# Altium schematic sheet VCU.SchDoc
size A3; SheetNumber: 1; SheetTotal: 1
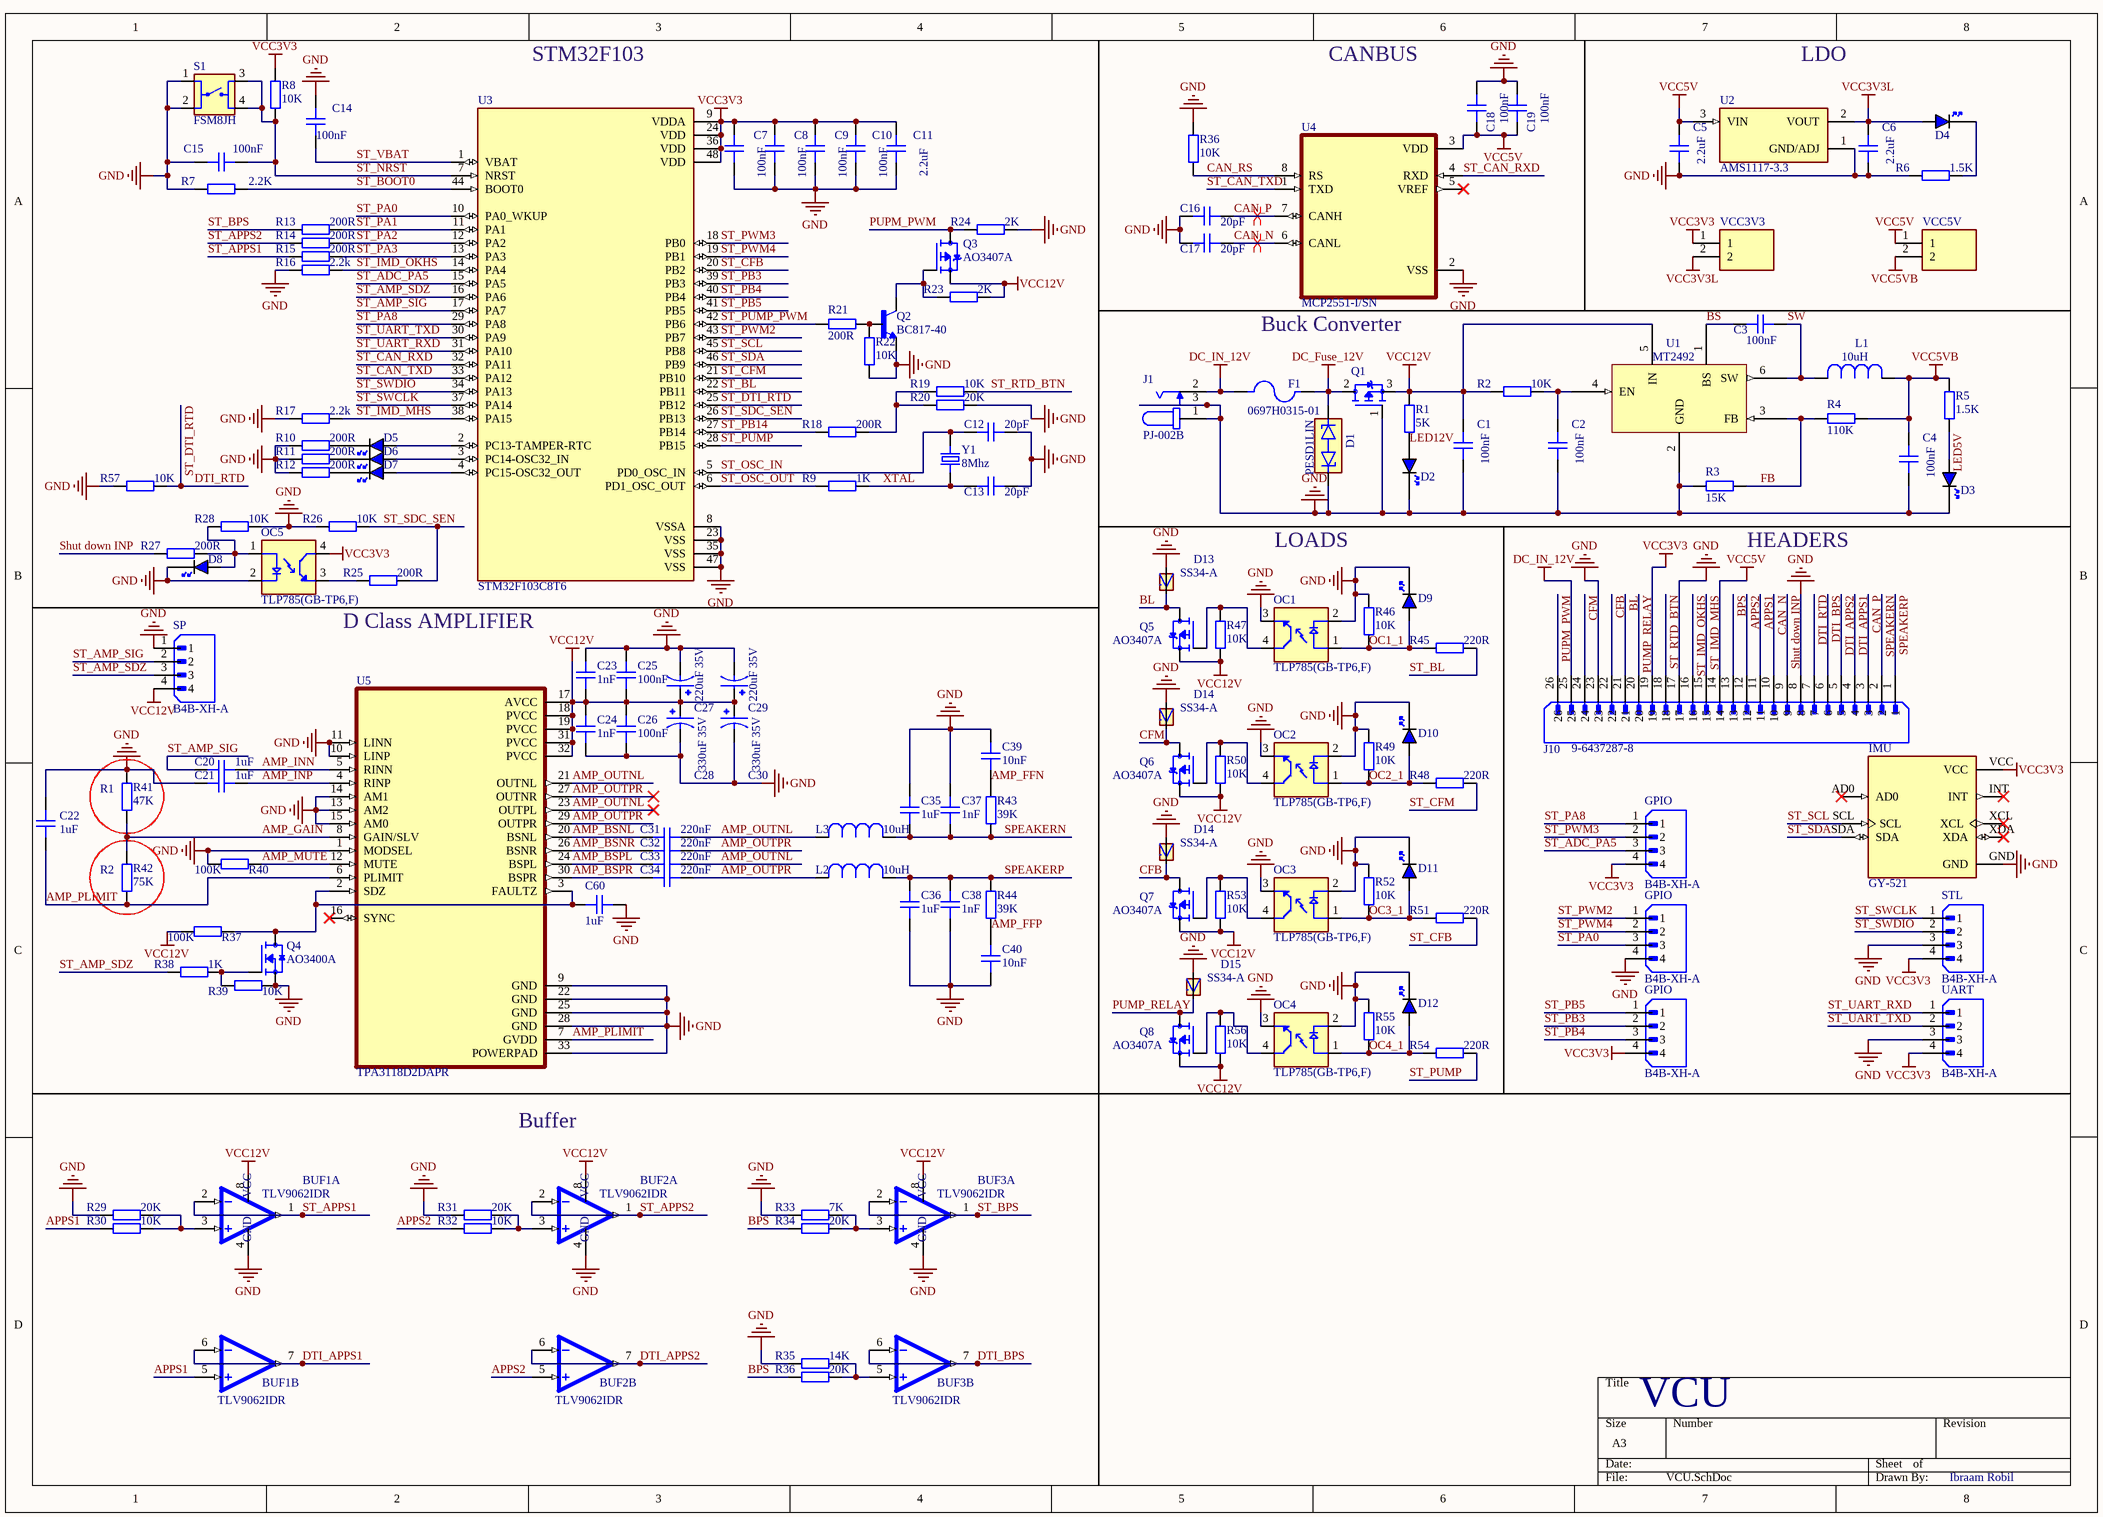
[diagram p0: VCU.SchDoc]

## Parts
(Parts that share a designator on the sheet are numbered #1, #2 ... from top to bottom, then left to right.)
BUF1  TLV9062IDR  [SOIC127P599X175-8N]  (parts A,B of 2)
BUF2  TLV9062IDR  [SOIC127P599X175-8N]  (parts A,B of 2)
BUF3  TLV9062IDR  [SOIC127P599X175-8N]  (parts A,B of 2)
C1  100nF  [CAP_0805]
C2  100nF  [CAP_0805]
C3  100nF  [CAP_0805]
C4  100nF  [CAP_0805]
C5  2.2uF  [CAP_0805]
C6  2.2uF  [CAP_0805]
C7  100nF  [CAP_0805]
C8  100nF  [CAP_0805]
C9  100nF  [CAP_0805]
C10  100nF  [CAP_0805]
C11  2.2uF  [CAP_0805]
C12  20pF  [CAP_0805]
C13  20pF  [CAP_0805]
C14  100nF  [CAP_0805]
C15  100nF  [CAP_0805]
C16  20pF  [CAP_0805]
C17  20pF  [CAP_0805]
C18  100nF  [CAP_0805]
C19  100nF  [CAP_0805]
C20  1uF  [CAP_0805]
C21  1uF  [CAP_0805]
C22  1uF  [CAP_0805]
C23  1nF  [CAP_0805]
C24  1nF  [CAP_0805]
C25  100nF  [CAP_0805]
C26  100nF  [CAP_0805]
C27  220uF 35V  [CAP_EEEFT1E471AP]
C28  330uF 35V  [CAP_EEEFT1E471AP]
C29  220uF 35V  [CAP_EEEFT1E471AP]
C30  330uF 35V  [CAP_EEEFT1E471AP]
C31  220nF  [CAP_0805]
C32  220nF  [CAP_0805]
C33  220nF  [CAP_0805]
C34  220nF  [CAP_0805]
C35  1uF  [CAP_0805]
C36  1uF  [CAP_0805]
C37  1nF  [CAP_0805]
C38  1nF  [CAP_0805]
C39  10nF  [CAP_0805]
C40  10nF  [CAP_0805]
C60  1uF  [CAP_0805]
D1  PESD1LIN  [DIO_PESD1LIN]
D2  BLUE  [LED_0805_BLUE]  (value not drawn)
D3  BLUE  [LED_0805_BLUE]  (value not drawn)
D4  BLUE  [LED_0805_BLUE]  (value not drawn)
D5  BLUE  [LED_0805_BLUE]  (value not drawn)
D6  BLUE  [LED_0805_BLUE]  (value not drawn)
D7  BLUE  [LED_0805_BLUE]  (value not drawn)
D8  BLUE  [LED_0805_BLUE]  (value not drawn)
D9  BLUE  [LED_0805_BLUE]  (value not drawn)
D10  BLUE  [LED_0805_BLUE]  (value not drawn)
D11  BLUE  [LED_0805_BLUE]  (value not drawn)
D12  BLUE  [LED_0805_BLUE]  (value not drawn)
D13  SS34-A  [DO-214AC]
D14#1  SS34-A  [DO-214AC]
D14#2  SS34-A  [DO-214AC]
D15  SS34-A  [DO-214AC]
F1  0697H0315-01  [FUSRR508W60L835T400H810]
GPIO#1  B4B-XH-A  [JST_B4B-XH-A]
GPIO#2  B4B-XH-A  [JST_B4B-XH-A]
GPIO#3  B4B-XH-A  [JST_B4B-XH-A]
IMU  GY-521  [MODULE_GY-521]
J1  PJ-002B  [CUI_PJ-002B]
J10  9-6437287-8  [TE_9-6437287-8]
L1  10uH  [IND_CDRH127/LDNP-470MC_SUM]
L2  10uH  [IND_CDRH127/LDNP-470MC_SUM]
L3  10uH  [IND_CDRH127/LDNP-470MC_SUM]
OC1  TLP785(GB-TP6,F)  [SOIC254P960X420-4N]
OC2  TLP785(GB-TP6,F)  [SOIC254P960X420-4N]
OC3  TLP785(GB-TP6,F)  [SOIC254P960X420-4N]
OC4  TLP785(GB-TP6,F)  [SOIC254P960X420-4N]
OC5  TLP785(GB-TP6,F)  [SOIC254P960X420-4N]
Q1  IRF4905STRRPBF  [TRANS_IRF4905STRRPBF]  (value not drawn)
Q2  BC817-40  [SOT95P240X120-3N]
Q3  AO3407A  [SOT95P280X125-3N]
Q4  AO3400A  [SOT95P280X125-3N]
Q5  AO3407A  [SOT95P280X125-3N]
Q6  AO3407A  [SOT95P280X125-3N]
Q7  AO3407A  [SOT95P280X125-3N]
Q8  AO3407A  [SOT95P280X125-3N]
R1  5K  [RES_0805]
R2  10K  [RES_0805]
R3  15K  [RES_0805]
R4  110K  [RES_0805]
R5  1.5K  [RES_0805]
R6  1.5K  [RES_0805]
R7  2.2K  [RES_0805]
R8  10K  [RES_0805]
R9  1K  [RES_0805]
R10  200R  [RES_0805]
R11  200R  [RES_0805]
R12  200R  [RES_0805]
R13  200R  [RES_0805]
R14  200R  [RES_0805]
R15  200R  [RES_0805]
R16  2.2k  [RES_0805]
R17  2.2k  [RES_0805]
R18  200R  [RES_0805]
R19  10K  [RES_0805]
R20  20K  [RES_0805]
R21  200R  [RES_0805]
R22  10K  [RES_0805]
R23  2K  [RES_0805]
R24  2K  [RES_0805]
R25  200R  [RES_0805]
R26  10K  [RES_0805]
R27  200R  [RES_0805]
R28  10K  [RES_0805]
R29  20K  [RES_0805]
R30  10K  [RES_0805]
R31  20K  [RES_0805]
R32  10K  [RES_0805]
R33  7K  [RES_0805]
R34  20K  [RES_0805]
R35  14K  [RES_0805]
R36#1  10K  [RES_0805]
R36#2  20K  [RES_0805]
R37  100K  [RES_0805]
R38  1K  [RES_0805]
R39  10K  [RES_0805]
R40  100K  [RES_0805]
R41  47K  [RES_0805]
R42  75K  [RES_0805]
R43  39K  [RES_0805]
R44  39K  [RES_0805]
R45  220R  [RES_0805]
R46  10K  [RES_0805]
R47  10K  [RES_0805]
R48  220R  [RES_0805]
R49  10K  [RES_0805]
R50  10K  [RES_0805]
R51  220R  [RES_0805]
R52  10K  [RES_0805]
R53  10K  [RES_0805]
R54  220R  [RES_0805]
R55  10K  [RES_0805]
R56  10K  [RES_0805]
R57  10K  [RES_0805]
S1  FSM8JH  [SW_FSM8JH]
SP  B4B-XH-A  [JST_B4B-XH-A]
STL  B4B-XH-A  [JST_B4B-XH-A]
U1  MT2492  [PCBComponent_1 - duplicate]
U2  AMS1117-3.3  [SOT229P700X180-4N]
U3  STM32F103C8T6  [QFP50P900X900X160-48N]
U4  MCP2551-I/SN  [SOIC127P599X175-8N]
U5  TPA3118D2DAPR  [SOP65P810X120-33N]
UART  B4B-XH-A  [JST_B4B-XH-A]
VCC3V3  3-644456-2  [TE_3-644456-2]  (value not drawn)
VCC5V  3-644456-2  [TE_3-644456-2]  (value not drawn)
Y1  8Mhz  [XTAL_ECS-80-20-5PVX]

## Nets
DC_Fuse_12V: D1.2 F1.2 Q1.2(D)
DC_IN_12V: F1.1 J1.2 J10.25
GND: BUF1.4(V-) BUF2.4(V-) BUF3.4(V-) C1.2 C2.2 C4.2 C5.2 C6.2 C7.1 C8.1 C9.1 C10.1 C11.2 C12.1 C13.1 C14.1 C15.2 C16.2 C17.2 C18.2 C19.2 C21.1 C22.2 C23.2 C24.1 C25.2 C26.1 C27.2 C28.2 C29.2 C30.2 C35.2 C36.2 C37.2 C38.2 C39.2 C40.2 C60.1 D1.1 D2.K D3.K D8.K D9.K D10.K D11.K D12.K D13.A D14#1.A D14#2.A D15.A GPIO#2.4 IMU.GND J1.1 J1.3 J10.8 J10.17 J10.23 OC1.2(C) OC1.3(ET) OC2.2(C) OC2.3(ET) OC3.2(C) OC3.3(ET) OC4.2(C) OC4.3(ET) OC5.2(C) Q1.1(G) Q2.2(E) Q4.2(S) R3.1 R6.2 R7.1 R10.2 R11.2 R12.2 R16.2 R17.2 R20.2 R22.2 R24.1 R26.2 R28.1 R29.2 R31.2 R33.2 R35.2 R36#1.2 R39.1 R40.1 R41.2 R46.2 R49.2 R52.2 R55.2 R57.2 S1.1 S1.2 SP.1 STL.3 U1.2(GND) U2.1(GND/ADJ) U3.8(VSSA) U3.23(VSS) U3.35(VSS) U3.47(VSS) U4.2(VSS) U5.1(MODSEL) U5.9(GND) U5.10(LINP) U5.11(LINN) U5.13(AM2) U5.14(AM1) U5.15(AM0) U5.22(GND) U5.25(GND) U5.28(GND) U5.33(POWERPAD) UART.3
VCC3V3: C7.2 C8.2 C9.2 C10.2 C11.1 GPIO#1.4 GPIO#3.4 IMU.VCC J10.19 OC5.4(CT) R8.2 STL.4 U3.9(VDDA) U3.24(VDD) U3.36(VDD) U3.48(VDD) UART.4 VCC3V3.1
VCC3V3L: C6.1 D4.A U2.2(VOUT) VCC3V3.2
VCC5V: C5.1 C18.1 C19.1 J10.14 U2.3(VIN) U4.3(VDD) VCC5V.1
VCC5VB: C4.1 L1.1 R4.2 R5.2 VCC5V.2
VCC12V: BUF1.8(V+) BUF2.8(V+) BUF3.8(V+) C1.1 C23.1 C24.2 C25.1 C26.2 C27.1 C28.1 C29.1 C30.1 Q1.3(S) Q3.2(S) Q5.2(S) Q6.2(S) Q7.2(S) Q8.2(S) R1.2 R2.2 R23.2 R37.1 R47.1 R50.1 R53.1 R56.1 SP.4 U1.5(IN) U5.17(AVCC) U5.18(PVCC) U5.19(PVCC) U5.31(PVCC) U5.32(PVCC)
AMP_BSNL: C31.2 U5.20(BSNL)
AMP_BSNR: C32.2 U5.26(BSNR)
AMP_BSPL: C33.2 U5.24(BSPL)
AMP_BSPR: C34.2 U5.30(BSPR)
AMP_FFN: C39.1 R43.2
AMP_FFP: C40.1 R44.2
AMP_GAIN: R41.1 R42.2 U5.8(GAIN/SLV)
AMP_INN: C20.2 U5.5(RINN)
AMP_INP: C21.2 U5.4(RINP)
AMP_MUTE: R40.2 U5.12(MUTE)
AMP_OUTNL: C31.1 C33.1 L3.2 U5.21(OUTNL) U5.23(OUTPL)
AMP_OUTPR: C32.1 C34.1 L2.2 U5.27(OUTNR) U5.29(OUTPR)
AMP_PLIMIT: C22.1 R42.1 U5.6(PLIMIT) U5.7(GVDD)
APPS1: BUF1.5(2IN+) J10.11 R30.2
APPS2: BUF2.5(2IN+) J10.12 R32.2
BL: D13.C J10.21 Q5.3(D)
BPS: J10.13 R34.2 R36#2.2
BS: C3.1 U1.1(BS)
CAN_N: C17.1 J10.10 U4.6(CANL)
CAN_P: C16.1 J10.3 U4.7(CANH)
CAN_RS: R36#1.1 U4.8(RS)
CFB: D14#2.C J10.22 Q7.3(D)
CFM: D14#1.C J10.24 Q6.3(D)
DTI_APPS1: BUF1.6(2IN-) BUF1.7(2OUT) J10.4
DTI_APPS2: BUF2.6(2IN-) BUF2.7(2OUT) J10.5
DTI_BPS: BUF3.6(2IN-) BUF3.7(2OUT) J10.6
DTI_RTD: J10.7 R57.1 U3.25(PB12)  [also labelled ST_DTI_RTD]
FB: R3.2 R4.1 U1.3(FB)
LED5V: D3.A R5.1
LED12V: D2.A R1.1
OC1_1: D9.A OC1.1(A) R45.2 R46.1
OC2_1: D10.A OC2.1(A) R48.2 R49.1
OC3_1: D11.A OC3.1(A) R51.2 R52.1
OC4_1: D12.A OC4.1(A) R54.2 R55.1
PUMP_RELAY: D15.C J10.20 Q8.3(D)
PUPM_PWM: J10.26 Q3.3(D) R24.2
Shut down INP: J10.9 R27.2
SPEAKERN: C35.1 C37.1 J10.2 L3.1 R43.1
SPEAKERP: C36.1 C38.1 J10.1 L2.1 R44.1
ST_ADC_PA5: GPIO#1.3 U3.15(PA5)
ST_AMP_SDZ: R38.1 SP.3 U3.16(PA6)
ST_AMP_SIG: C20.1 SP.2 U3.17(PA7)
ST_APPS1: BUF1.1(1OUT) BUF1.2(1IN-) R15.2
ST_APPS2: BUF2.1(1OUT) BUF2.2(1IN-) R14.2
ST_BL: R45.1 U3.22(PB11)
ST_BOOT0: R7.2 U3.44(BOOT0)
ST_BPS: BUF3.1(1OUT) BUF3.2(1IN-) R13.2
ST_CAN_RXD: U3.32(PA11) U4.4(RXD)
ST_CAN_TXD: U3.33(PA12) U4.1(TXD)
ST_CFB: R51.1 U3.20(PB2)
ST_CFM: R48.1 U3.21(PB10)
ST_IMD_MHS: J10.15 R17.1 U3.38(PA15)
ST_IMD_OKHS: J10.16 R16.1 U3.14(PA4)
ST_NRST: C15.1 R8.1 S1.3 S1.4 U3.7(NRST)
ST_OSC_IN: C12.2 U3.5(PD0_OSC_IN) Y1.1
ST_OSC_OUT: R9.1 U3.6(PD1_OSC_OUT)
ST_PA0: GPIO#2.3 U3.10(PA0_WKUP)
ST_PA1: R13.1 U3.11(PA1)
ST_PA2: R14.1 U3.12(PA2)
ST_PA3: R15.1 U3.13(PA3)
ST_PA8: GPIO#1.1 U3.29(PA8)
ST_PB3: GPIO#3.2 U3.39(PB3)
ST_PB4: GPIO#3.3 U3.40(PB4)
ST_PB5: GPIO#3.1 U3.41(PB5)
ST_PB14: R18.1 U3.27(PB14)
ST_PUMP: R54.1 U3.28(PB15)
ST_PUMP_PWM: R21.2 U3.42(PB6)
ST_PWM2: GPIO#2.1 U3.43(PB7)
ST_PWM3: GPIO#1.2 U3.18(PB0)
ST_PWM4: GPIO#2.2 U3.19(PB1)
ST_RTD_BTN: J10.18 R19.2
ST_SCL: IMU.SCL U3.45(PB8)
ST_SDA: IMU.SDA U3.46(PB9)
ST_SDC_SEN: R25.2 R26.1 U3.26(PB13)
ST_SWCLK: STL.1 U3.37(PA14)
ST_SWDIO: STL.2 U3.34(PA13)
ST_UART_RXD: U3.31(PA10) UART.1
ST_UART_TXD: U3.30(PA9) UART.2
ST_VBAT: C14.2 U3.1(VBAT)
SW: C3.2 L1.2 U1.6(SW)
XTAL: C13.2 R9.2 Y1.2
NetBUF1_3: BUF1.3(1IN+) R29.1 R30.1
NetBUF2_3: BUF2.3(1IN+) R31.1 R32.1
NetBUF3_3: BUF3.3(1IN+) R33.1 R34.1
NetBUF3_5: BUF3.5(2IN+) R35.1 R36#2.1
NetC2_1: C2.1 R2.1 U1.4(EN)
NetC60_2: C60.2 Q4.3(D) R37.2 U5.2(SDZ) U5.3(FAULTZ)
NetD4_K: D4.K R6.1
NetD5_A: D5.A U3.2(PC13-TAMPER-RTC)
NetD5_K: D5.K R10.1
NetD6_A: D6.A U3.3(PC14-OSC32_IN)
NetD6_K: D6.K R11.1
NetD7_A: D7.A U3.4(PC15-OSC32_OUT)
NetD7_K: D7.K R12.1
NetD8_A: D8.A OC5.1(A) R27.1 R28.2
NetOC1_4: OC1.4(CT) Q5.1(G) R47.2
NetOC2_4: OC2.4(CT) Q6.1(G) R50.2
NetOC3_4: OC3.4(CT) Q7.1(G) R53.2
NetOC4_4: OC4.4(CT) Q8.1(G) R56.2
NetOC5_3: OC5.3(ET) R25.1
NetQ2_1: Q2.1(B) R21.1 R22.1
NetQ2_3: Q2.3(C) Q3.1(G) R23.1
NetQ4_1: Q4.1(G) R38.2 R39.2
NetR18_2: R18.2 R19.1 R20.1

Not connected (* = marked no-connect by the designer): IMU AD0* INT* XCL* XDA*; U4 5(VREF)*; U5 16(SYNC)*

## Layout directives
differential pair: CAN_N, CAN_P

## Notes on the sheet
- STM32F103
- CANBUS
- LDO
- Buck Converter
- LOADS
- (near R3) HEADERS
- D Class AMPLIFIER
- (near R41) R1
- (near R42) R2
- Buffer
- VCU
- Ibraam Robil
- (in symbol TLV9062IDR, part A) VCC; GND

## Library data of the parts
BUF1-BUF3 = TLV9062IDR: Dual, 5.5-V, 10-MHz operational amplifier; MF: Texas Instruments; SnapEDA_Link: https://www.snapeda.com/parts/TLV9062IDR/Texas+Instruments/view-part/?ref=snap; Package: SOIC-8 Texas Instruments; Value: *; MP: TLV9062IDR; Check_prices: https://www.snapeda.com/parts/TLV9062IDR/Texas+Instruments/view-part/?ref=eda
C1-C26 C31-C40 C60 = CAP_0805: Capacitor SMD 0805; Manufacturer: *; Manufacturer Part Number: *; Distributor Link: *; LCSC: *; Rating: *; Dielectric: *
C27-C30 = EEEFT1E471AP: Cap Aluminum Lytic 470uF 25V 20% (8 X 10.2mm) SMD 0.08 Ohm 850mA 2000h 105C Automotive T/R; MF: Panasonic; SnapEDA_Link: https://www.snapeda.com/parts/EEEFT1E471AP/Panasonic/view-part/?ref=snap; Package: RADIAL-2 Panasonic; Value: *; MP: EEEFT1E471AP; Check_prices: https://www.snapeda.com/parts/EEEFT1E471AP/Panasonic/view-part/?ref=eda
D1 = PESD1LIN: 44V, 70V Clamp 3A (8/20Âµs) Ipp Tvs Diode Surface Mount SOD-323; MF: Nexperia USA; SnapEDA_Link: https://www.snapeda.com/parts/PESD1LIN/Nexperia/view-part/?ref=snap; Package: SOD-323 Vishay Semiconductor Diodes Division; Value: *; MP: PESD1LIN; Check_prices: https://www.snapeda.com/parts/PESD1LIN/Nexperia/view-part/?ref=eda
D2-D12 = LED_0805_BLUE: LED 0805 BLUE SMD; Manufacturer: *; Manufacturer Part Number: *; Distributor Link: *; LCSC: *
D13 D14#1 D14#2 D15 = SS34-A: Schottky barrier diode, 3A, 40V; MF: hy electronic corp; MP: SS34A; SnapEDA_Link: https://www.snapeda.com/parts/SS34A/HY+Electronic/view-part/?ref=snap; Package: None; Value: *; Check_prices: https://www.snapeda.com/parts/SS34A/HY+Electronic/view-part/?ref=eda
F1 = 0697H0315-01: 2-Pin Radial Fuse | Rectangular | Slow Blow | UL | 315mA; MF: Bel Fuse; SnapEDA_Link: https://www.snapeda.com/parts/0697H0315-01/Bel+Circuit+Protection/view-part/?ref=snap; Package: Radial Box  Bel Fuse; Value: *; MP: 0697H0315-01; Check_prices: https://www.snapeda.com/parts/0697H0315-01/Bel+Circuit+Protection/view-part/?ref=eda
GPIO#1-GPIO#3 SP STL UART = B4B-XH-A: Connector Header Through Hole 4 position 0.098 (2.50mm); MF: JST Sales; SnapEDA_Link: https://www.snapeda.com/parts/B4B-XH-A/JST/view-part/?ref=snap; Package: None; Value: *; MP: B4B-XH-A; Check_prices: https://www.snapeda.com/parts/B4B-XH-A/JST/view-part/?ref=eda
IMU = GY-521: Triple Axis Accelerometer Gyro Breakout; MF: GODREAM FORDREAM CO., LIMITED; SnapEDA_Link: https://www.snapeda.com/parts/GY-521/GODREAM+FORDREAM+CO.%252C+LIMITED/view-part/?ref=snap; Package: Package; Value: *; MP: GY-521; Check_prices: https://www.snapeda.com/parts/GY-521/GODREAM+FORDREAM+CO.%252C+LIMITED/view-part/?ref=eda
J1 = PJ-002B: 2.5 x 6.5 mm, 2.5 A, Horizontal, Through Hole, Dc Power Jack Connector; MF: Same Sky; SnapEDA_Link: https://www.snapeda.com/parts/PJ-002B/Same+Sky/view-part/?ref=snap; Package: None; Value: *; MP: PJ-002B; Check_prices: https://www.snapeda.com/parts/PJ-002B/Same+Sky/view-part/?ref=eda
J10 = 9-6437287-8: MF: {'manufacturer': 'TE Connectivity'}; Package: None; Value: *; Availability: Unavailable; MP: 9-6437287-8; Price: None
L1-L3 = CDRH127/LDNP-470MC: Inductor Power Shielded Drum Core 47uH 20% 1KHz Ferrite 4.1A 0.078Ohm DCR T/R; MF: Sumida Corporation; SnapEDA_Link: https://www.snapeda.com/parts/CDRH127/LDNP-470MC/Sumida/view-part/?ref=snap; Package: Non Standard Sumida; Value: *; MP: CDRH127/LDNP-470MC; Check_prices: https://www.snapeda.com/parts/CDRH127/LDNP-470MC/Sumida/view-part/?ref=eda
OC1-OC5 = PC817X1NIP1B: Optoisolator Transistor Output 1 Channel 4-SMD; MF: Sharp Microelectronics; SnapEDA_Link: https://www.snapeda.com/parts/PC817X1NIP1B/Sharp+Microelectronics/view-part/?ref=snap; Package: None; Value: *; MP: PC817X1NIP1B; Check_prices: https://www.snapeda.com/parts/PC817X1NIP1B/Sharp+Microelectronics/view-part/?ref=eda
Q1 = IRF4905STRRPBF: RoHS Compliant | Low RDS(on) | Industry-leading quality | Dynamic dv/dt Rating | Fast Switching | Fully Avalanche Rated | 175C Operating Temperature | P-Channel MOSFET; MF: Infineon Technologies; Package: D2PAK Infineon; Price: None; Availability: In Stock; Purchase-URL: https://pricing.snapeda.com/search/part/IRF4905STRRPBF/?ref=eda; Check_prices: https://www.snapeda.com/parts/IRF4905STRRPBF/Infineon+Technologies/view-part/?ref=eda; MP: IRF4905STRRPBF; SnapEDA_Link: https://www.snapeda.com/parts/IRF4905STRRPBF/Infineon+Technologies/view-part/?ref=snap; Value: *
Q2 = BC817-40: BJT, SOT-23, 45V, 800mA, NPN, 0.31W, 150Â°C; MF: Diotec Semiconductor; SnapEDA_Link: https://www.snapeda.com/parts/BC817-40/Diotec/view-part/?ref=snap; Package: SOT-23 Diotec; Value: *; MP: BC817-40; Check_prices: https://www.snapeda.com/parts/BC817-40/Diotec/view-part/?ref=eda
Q3 Q5-Q8 = AO3407A: P-Channel 30 V 4.3A (Ta) 1.4W (Ta) Surface Mount SOT-23-3; MF: Alpha &; SnapEDA_Link: https://www.snapeda.com/parts/AO3407A/Alpha/view-part/?ref=snap; Package: SOT-23 Alpha &amp; Omega Semiconductor; Value: *; MP: AO3407A; Check_prices: https://www.snapeda.com/parts/AO3407A/Alpha/view-part/?ref=eda
Q4 = AO3400A: N-Channel 30 V 5.8A (Ta) 1.4W (Ta) Surface Mount SOT-23; MF: UMW; SnapEDA_Link: https://www.snapeda.com/parts/AO3400A/UMW/view-part/?ref=snap; Package: None; Value: *; MP: AO3400A; Check_prices: https://www.snapeda.com/parts/AO3400A/UMW/view-part/?ref=eda
R1-R35 R36#1 R36#2 R37-R57 = RES_0805: Resistor SMD 0805; Manufacturer: *; Manufacturer Part Number: *; Distributor Link: *; LCSC: *
S1 = FSM8JH: Tactile Switch SPST-NO Top Actuated Through Hole; MF: TE Connectivity; Check_prices: https://www.snapeda.com/parts/FSM8JH/TE+Connectivity+ALCOSWITCH+Switches/view-part/?ref=eda; Value: *; Availability: In Stock; MP: FSM8JH; Price: None; Package: None; SnapEDA_Link: https://www.snapeda.com/parts/FSM8JH/TE+Connectivity+ALCOSWITCH+Switches/view-part/?ref=snap
U1 = MT2492: DC-DC step-down converter (buck converter)
U2 = AMS1117-3.3: Sot223/Pkg 1-Amp 3.3-Volt Low Drop Out Voltage Regulatator; MF: Advanced Monolithic Systems; SnapEDA_Link: https://www.snapeda.com/parts/AMS1117-3.3/Advanced+Monolithic+Systems/view-part/?ref=snap; Package: SOT-223 Seeed Technology; Value: *; MP: AMS1117-3.3; Check_prices: https://www.snapeda.com/parts/AMS1117-3.3/Advanced+Monolithic+Systems/view-part/?ref=eda
U3 = STM32F103C8T6: ARM® Cortex®-M3 STM32F1 Microcontroller IC 32-Bit 72MHz 64KB (64K x 8) FLASH 48-LQFP (7x7); MF: STMicroelectronics; SnapEDA_Link: https://www.snapeda.com/parts/STM32F103C8T6/STMicroelectronics/view-part/?ref=snap; Package: LQFP-48 STMicroelectronics; Value: *; MP: STM32F103C8T6; Check_prices: https://www.snapeda.com/parts/STM32F103C8T6/STMicroelectronics/view-part/?ref=eda
U5 = TPA3118D2DAPR: 30-W stereo, 60-W mono, 4.5- to 26-V supply, analog input Class-D audio amplifier; MF: Texas Instruments; SnapEDA_Link: https://www.snapeda.com/parts/TPA3118D2DAPR/Texas+Instruments/view-part/?ref=snap; Package: HTSSOP-32 Texas Instruments; Value: *; MP: TPA3118D2DAPR; Check_prices: https://www.snapeda.com/parts/TPA3118D2DAPR/Texas+Instruments/view-part/?ref=eda
VCC3V3 VCC5V = 3-644456-2: HEADER ASSEMBLY, NARROW, MTA-100, 2 POSITION, STRAIGHT | TE Connectivity 3-644456-2; SnapEDA_Link: https://www.snapeda.com/parts/3-644456-2/TE+Connectivity+AMP+Connectors/view-part/?ref=snap; Package: None; Value: *; MF: TE Connectivity; MP: 3-644456-2; Check_prices: https://www.snapeda.com/parts/3-644456-2/TE+Connectivity+AMP+Connectors/view-part/?ref=eda
Y1 = ECS-80-20-5PVX: SMD Quartz crystal; Package: None; Price: None; Value: *; MP: ECS-80-20-5PVX; Availability: Unavailable
U4 = MCP2551-I/SN: Package: None; MP: MCP2551-I/SN; Price: None; Availability: Unavailable; Value: *